# Altium schematic sheet ECU.SchDoc
size A; SheetNumber: 1; SheetTotal: 4
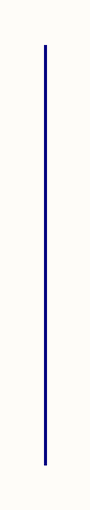
[diagram p0: ECU.SchDoc]